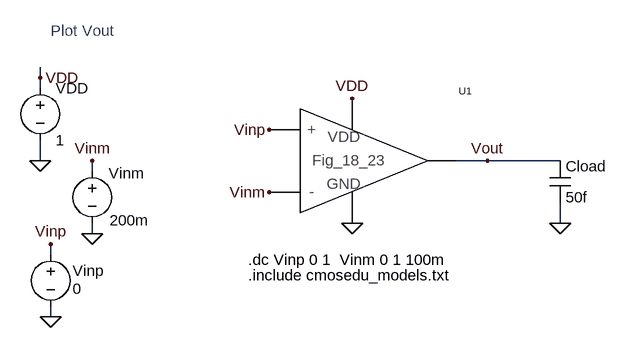
[diagram p0: schematic Fig18_24_symbol.asc]
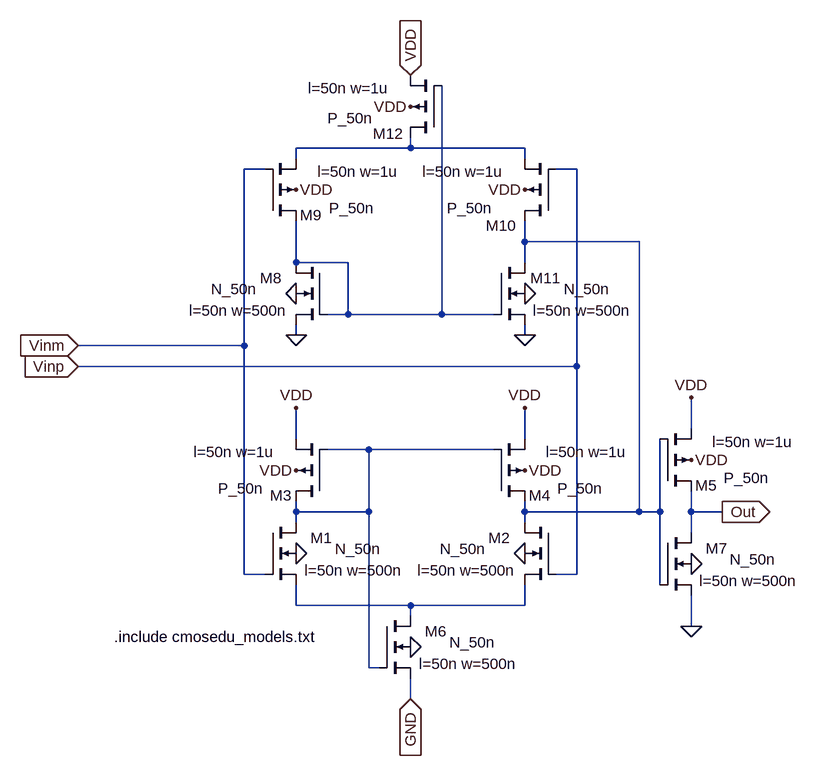
[diagram p1: sub-circuit fig_18_23.asc]
Fig18_24_symbol.asc, the LTspice schematic file:
Version 4
SHEET 1 1496 680
WIRE 224 -544 224 -560
WIRE 224 -528 224 -544
WIRE 224 -416 224 -448
WIRE 912 -416 864 -416
WIRE 1024 -416 912 -416
WIRE 304 -400 304 -416
WIRE 1024 -320 1024 -352
WIRE 304 -304 304 -320
WIRE 240 -272 240 -288
WIRE 240 -176 240 -192
FLAG 240 -176 0
FLAG 240 -288 Vinp
FLAG 224 -416 0
FLAG 224 -544 VDD
FLAG 304 -304 0
FLAG 304 -416 Vinm
FLAG 1024 -320 0
FLAG 912 -416 Vout
FLAG 704 -512 VDD
FLAG 576 -464 Vinp
FLAG 576 -368 Vinm
FLAG 704 -320 0
SYMBOL voltage 240 -288 R0
WINDOW 0 34 41 Left 0
WINDOW 3 34 69 Left 0
WINDOW 123 0 0 Left 0
WINDOW 39 0 0 Left 0
SYMATTR InstName Vinp
SYMATTR Value 0
SYMBOL voltage 224 -544 R0
WINDOW 123 0 0 Left 0
WINDOW 39 0 0 Left 0
SYMATTR InstName VDD
SYMATTR Value 1
SYMBOL voltage 304 -416 R0
WINDOW 0 25 19 Left 0
WINDOW 3 27 91 Left 0
WINDOW 123 0 0 Left 0
WINDOW 39 0 0 Left 0
SYMATTR InstName Vinm
SYMATTR Value 200m
SYMBOL cap 1008 -416 R0
SYMATTR InstName Cload
SYMATTR Value 50f
SYMBOL Fig_18_23 624 -416 R0
SYMATTR InstName U1
TEXT 544 -264 Left 0 !.dc Vinp 0 1  Vinm 0 1 100m
TEXT 544 -240 Left 0 !.include cmosedu_models.txt
TEXT 240 -616 Left 0 ;Plot Vout

fig_18_23.asc, the sub-circuit schematic file:
Version 4
SHEET 1 1496 680
WIRE 768 -1072 768 -1088
WIRE 768 -1072 592 -1072
WIRE 944 -1072 768 -1072
WIRE 592 -1056 592 -1072
WIRE 944 -1056 944 -1072
WIRE 544 -1040 512 -1040
WIRE 1024 -1040 992 -1040
WIRE 944 -928 944 -960
WIRE 1120 -928 944 -928
WIRE 592 -896 592 -960
WIRE 672 -896 592 -896
WIRE 944 -896 944 -928
WIRE 672 -816 672 -896
WIRE 672 -816 640 -816
WIRE 816 -816 816 -1168
WIRE 816 -816 672 -816
WIRE 896 -816 816 -816
WIRE 592 -784 592 -800
WIRE 944 -784 944 -800
WIRE 512 -768 512 -1040
WIRE 512 -768 256 -768
WIRE 1024 -736 1024 -1040
WIRE 1024 -736 256 -736
WIRE 1200 -640 1200 -688
WIRE 592 -624 592 -672
WIRE 944 -624 944 -672
WIRE 704 -608 640 -608
WIRE 896 -608 704 -608
WIRE 592 -512 592 -528
WIRE 704 -512 704 -608
WIRE 704 -512 592 -512
WIRE 944 -512 944 -528
WIRE 1120 -512 1120 -928
WIRE 1120 -512 944 -512
WIRE 1152 -512 1152 -624
WIRE 1152 -512 1120 -512
WIRE 1200 -512 1200 -544
WIRE 1248 -512 1200 -512
WIRE 592 -496 592 -512
WIRE 944 -496 944 -512
WIRE 1200 -480 1200 -512
WIRE 512 -416 512 -768
WIRE 544 -416 512 -416
WIRE 1024 -416 1024 -736
WIRE 1024 -416 992 -416
WIRE 1152 -400 1152 -512
WIRE 592 -368 592 -400
WIRE 768 -368 592 -368
WIRE 944 -368 944 -400
WIRE 944 -368 768 -368
WIRE 768 -352 768 -368
WIRE 1200 -336 1200 -384
WIRE 704 -272 704 -512
WIRE 720 -272 704 -272
WIRE 768 -224 768 -256
FLAG 592 -448 0
FLAG 592 -576 VDD
FLAG 592 -672 VDD
FLAG 944 -576 VDD
FLAG 944 -448 0
FLAG 944 -672 VDD
FLAG 768 -304 0
FLAG 1200 -592 VDD
FLAG 1200 -688 VDD
FLAG 1200 -432 0
FLAG 1200 -336 0
FLAG 592 -848 0
FLAG 592 -1008 VDD
FLAG 944 -1008 VDD
FLAG 944 -848 0
FLAG 768 -1136 VDD
FLAG 592 -784 0
FLAG 944 -784 0
FLAG 768 -1184 VDD
IOPIN 768 -1184 In
FLAG 768 -224 GND
IOPIN 768 -224 In
FLAG 1248 -512 Out
IOPIN 1248 -512 Out
FLAG 256 -768 Vinm
IOPIN 256 -768 In
FLAG 256 -736 Vinp
IOPIN 256 -736 In
SYMBOL nmos4 544 -496 R0
WINDOW 0 104 24 Right 2
WINDOW 3 179 41 Right 2
WINDOW 123 213 74 Right 2
SYMATTR InstName M1
SYMATTR Value N_50n
SYMATTR Value2 l=50n w=500n
SYMBOL pmos4 640 -528 R180
WINDOW 0 88 9 Right 2
WINDOW 3 168 20 Right 2
WINDOW 123 206 76 Right 2
SYMATTR InstName M3
SYMATTR Value P_50n
SYMATTR Value2 l=50n w=1u
SYMBOL pmos4 896 -528 M180
WINDOW 0 88 9 Right 2
WINDOW 3 168 20 Right 2
WINDOW 123 206 76 Right 2
SYMATTR InstName M4
SYMATTR Value P_50n
SYMATTR Value2 l=50n w=1u
SYMBOL nmos4 992 -496 M0
WINDOW 0 104 24 Right 2
WINDOW 3 179 41 Right 2
WINDOW 123 213 74 Right 2
SYMATTR InstName M2
SYMATTR Value N_50n
SYMATTR Value2 l=50n w=500n
SYMBOL nmos4 720 -352 R0
WINDOW 0 104 24 Right 2
WINDOW 3 179 41 Right 2
WINDOW 123 213 74 Right 2
SYMATTR InstName M6
SYMATTR Value N_50n
SYMATTR Value2 l=50n w=500n
SYMBOL pmos4 1152 -544 M180
WINDOW 0 88 9 Right 2
WINDOW 3 168 20 Right 2
WINDOW 123 206 76 Right 2
SYMATTR InstName M5
SYMATTR Value P_50n
SYMATTR Value2 l=50n w=1u
SYMBOL nmos4 1152 -480 R0
WINDOW 0 104 24 Right 2
WINDOW 3 179 41 Right 2
WINDOW 123 213 74 Right 2
SYMATTR InstName M7
SYMATTR Value N_50n
SYMATTR Value2 l=50n w=500n
SYMBOL nmos4 640 -896 M0
WINDOW 0 104 24 Right 2
WINDOW 3 179 41 Right 2
WINDOW 123 213 74 Right 2
SYMATTR InstName M8
SYMATTR Value N_50n
SYMATTR Value2 l=50n w=500n
SYMBOL pmos4 544 -960 M180
WINDOW 0 88 9 Right 2
WINDOW 3 168 20 Right 2
WINDOW 123 206 76 Right 2
SYMATTR InstName M9
SYMATTR Value P_50n
SYMATTR Value2 l=50n w=1u
SYMBOL pmos4 992 -960 R180
WINDOW 0 108 -7 Right 2
WINDOW 3 168 20 Right 2
WINDOW 123 206 76 Right 2
SYMATTR InstName M10
SYMATTR Value P_50n
SYMATTR Value2 l=50n w=1u
SYMBOL nmos4 896 -896 R0
WINDOW 0 104 24 Right 2
WINDOW 3 179 41 Right 2
WINDOW 123 213 74 Right 2
SYMATTR InstName M11
SYMATTR Value N_50n
SYMATTR Value2 l=50n w=500n
SYMBOL pmos4 816 -1088 R180
WINDOW 0 106 6 Right 2
WINDOW 3 176 30 Right 2
WINDOW 123 206 76 Right 2
SYMATTR InstName M12
SYMATTR Value P_50n
SYMATTR Value2 l=50n w=1u
TEXT 312 -320 Left 2 !.include cmosedu_models.txt

The netlist it stands for:
* Fig18_24_symbol.asc
Vinp Vinp 0 0
VDD VDD 0 1
Vinm Vinm 0 200m
Cload Vout 0 50f
XU1 Vinp Vinm Vout VDD 0 fig_18_23

* block symbol definitions
.subckt fig_18_23 Vinp Vinm Out VDD GND
M1 N004 Vinm N005 0 N_50n l=50n w=500n
M3 N004 N004 VDD VDD P_50n l=50n w=1u
M4 N002 N004 VDD VDD P_50n l=50n w=1u
M2 N002 Vinp N005 0 N_50n l=50n w=500n
M6 N005 N004 GND 0 N_50n l=50n w=500n
M5 Out N002 VDD VDD P_50n l=50n w=1u
M7 Out N002 0 0 N_50n l=50n w=500n
M8 N003 N003 0 0 N_50n l=50n w=500n
M9 N003 Vinm N001 VDD P_50n l=50n w=1u
M10 N002 Vinp N001 VDD P_50n l=50n w=1u
M11 N002 N003 0 0 N_50n l=50n w=500n
M12 N001 N003 VDD VDD P_50n l=50n w=1u
.include cmosedu_models.txt
.ends fig_18_23

.model NMOS NMOS
.model PMOS PMOS
.lib standard.mos
.dc Vinp 0 1  Vinm 0 1 100m
.include cmosedu_models.txt
* Plot Vout
.backanno
.end